# Altium project Zoom Camrea Controller V3.0.PrjPcb
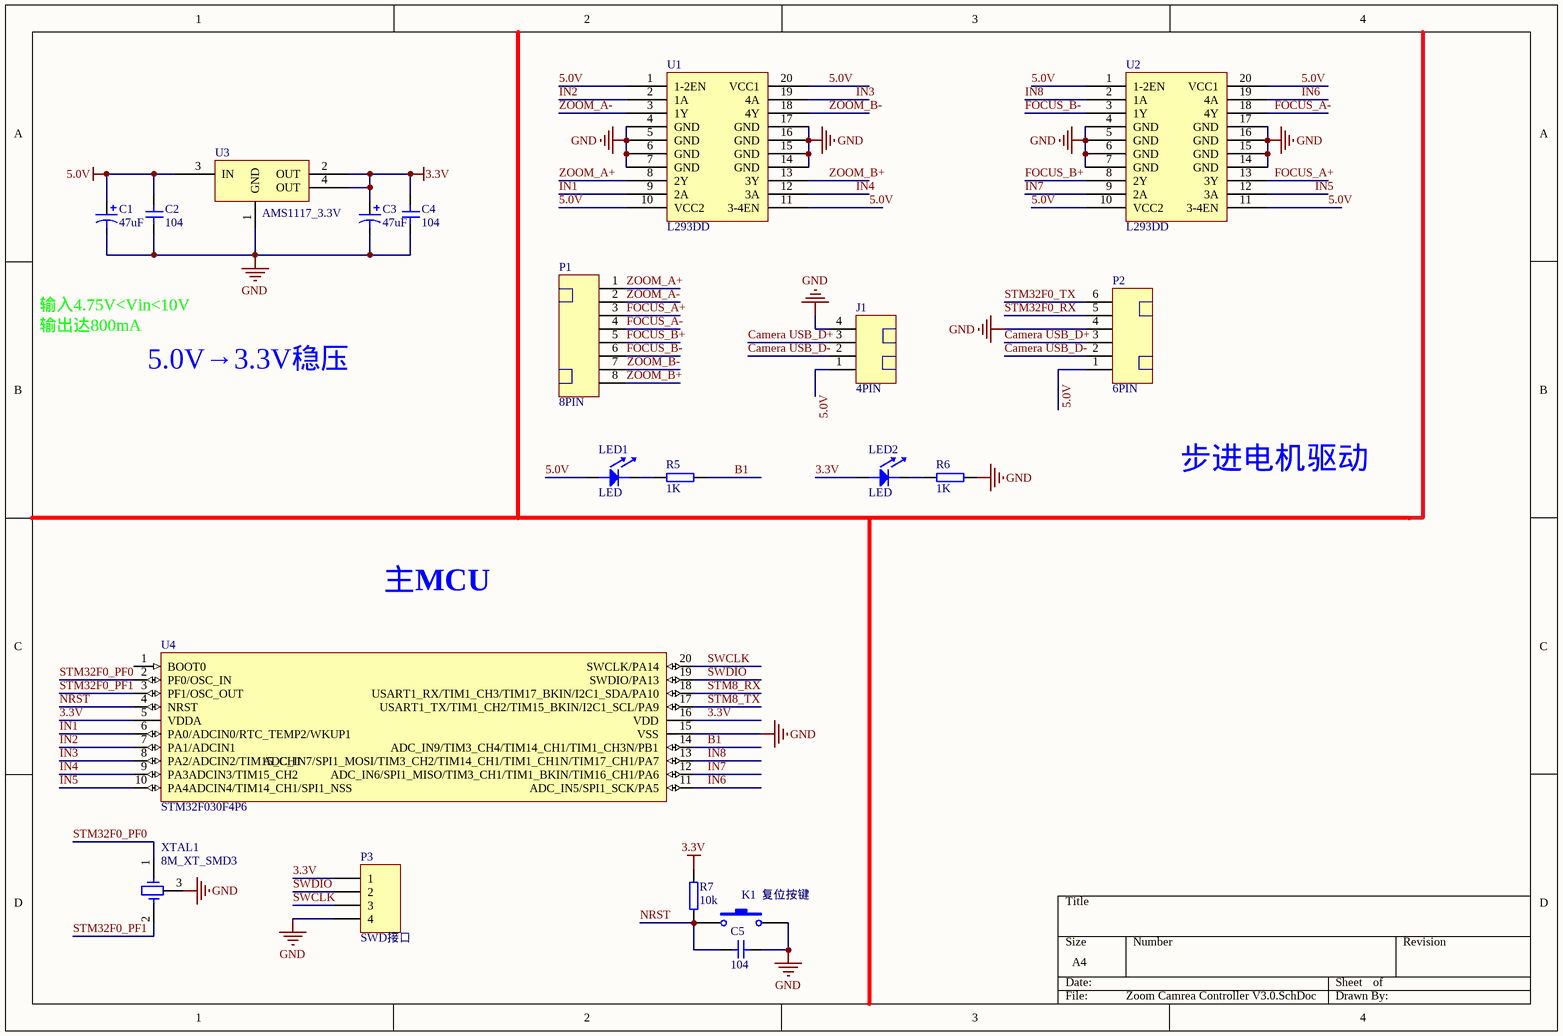
[diagram p0: Zoom Camrea Controller V3.0.SchDoc]
1 sheet, 20 parts. Net scope: global (net labels, ports and power ports of the same name join across sheets).
Board file: Zoom Camrea Controller V3.0.PcbDoc

## Sheet Zoom Camrea Controller V3.0.SchDoc
size A4

### Parts
C1  47uF  [TAJ-A]
C2  104  [0805C]
C3  47uF  [TAJ-A]
C4  104  [0805C]
C5  104  [0805C]
J1  4PIN  [MX1.25WS-4P]
K1  复位按键  [贴片按键]
LED1  LED  [0805LED(RED)]
LED2  LED  [0805LED(RED)]
P1  8PIN  [MX1.25WS-8P]
P2  6PIN  [MX1.25WS-6P]
P3  SWD接口  [Header 4]
R5  1K  [0805R]
R6  1K  [0805R]
R7  10k  [0805R]
U1  L293DD  [SOP-20]
U2  L293DD  [SOP-20]
U3  AMS1117_3.3V  [SOT-223]
U4  STM32F030F4P6  [STM32F030]
XTAL1  8M_XT_SMD3  [三脚贴片8M晶振]

### Nets
3.3V: C3.1 C4.2 LED2.1 P3.1 R7.2 U3.2(OUT) U3.4(OUT) U4.5(VDDA) U4.16(VDD)
5.0V: C1.1 C2.2 J1.1 LED1.1 P2.1 U1.1(1-2EN) U1.10(VCC2) U1.11(3-4EN) U1.20(VCC1) U2.1(1-2EN) U2.10(VCC2) U2.11(3-4EN) U2.20(VCC1) U3.3(IN)
GND: C1.2 C2.1 C3.2 C4.1 C5.1 J1.4 K1.2 P2.4 P3.4 R6.2 U1.4(GND) U1.5(GND) U1.6(GND) U1.7(GND) U1.14(GND) U1.15(GND) U1.16(GND) U1.17(GND) U2.4(GND) U2.5(GND) U2.6(GND) U2.7(GND) U2.14(GND) U2.15(GND) U2.16(GND) U2.17(GND) U3.1(GND) U4.15(VSS) XTAL1.3
B1: R5.2 U4.14(ADC_IN9/TIM3_CH4/TIM14_CH1/TIM1_CH3N/PB1)
Camera USB_D+: J1.3 P2.3
Camera USB_D-: J1.2 P2.2
FOCUS_A+: P1.3 U2.13(3Y)
FOCUS_A-: P1.4 U2.18(4Y)
FOCUS_B+: P1.5 U2.8(2Y)
FOCUS_B-: P1.6 U2.3(1Y)
IN1: U1.9(2A) U4.6(PA0/ADCIN0/RTC_TEMP2/WKUP1)
IN2: U1.2(1A) U4.7(PA1/ADCIN1)
IN3: U1.19(4A) U4.8(PA2/ADCIN2/TIM15_CH1)
IN4: U1.12(3A) U4.9(PA3ADCIN3/TIM15_CH2)
IN5: U2.12(3A) U4.10(PA4ADCIN4/TIM14_CH1/SPI1_NSS)
IN6: U2.19(4A) U4.11(ADC_IN5/SPI1_SCK/PA5)
IN7: U2.9(2A) U4.12(ADC_IN6/SPI1_MISO/TIM3_CH1/TIM1_BKIN/TIM16_CH1/PA6)
IN8: U2.2(1A) U4.13(ADC_IN7/SPI1_MOSI/TIM3_CH2/TIM14_CH1/TIM1_CH1N/TIM17_CH1/PA7)
NRST: C5.2 K1.1 R7.1 U4.4(NRST)
STM8_RX: U4.18(USART1_RX/TIM1_CH3/TIM17_BKIN/I2C1_SDA/PA10)
STM8_TX: U4.17(USART1_TX/TIM1_CH2/TIM15_BKIN/I2C1_SCL/PA9)
STM32F0_PF0: U4.2(PF0/OSC_IN) XTAL1.1
STM32F0_PF1: U4.3(PF1/OSC_OUT) XTAL1.2
STM32F0_RX: P2.5
STM32F0_TX: P2.6
SWCLK: P3.3 U4.20(SWCLK/PA14)
SWDIO: P3.2 U4.19(SWDIO/PA13)
ZOOM_A+: P1.1 U1.8(2Y)
ZOOM_A-: P1.2 U1.3(1Y)
ZOOM_B+: P1.8 U1.13(3Y)
ZOOM_B-: P1.7 U1.18(4Y)
NetLED1_2: LED1.2 R5.1
NetLED2_2: LED2.2 R6.1

Not connected (* = marked no-connect by the designer): U4 1(BOOT0)

### Notes on the sheet
- 输入4.75V<Vin<10V
- 输出达800mA
- 5.0V→3.3V稳压
- 步进电机驱动
- 主MCU

### Library data of the parts
C1 C3 = Pol Cap: 极性贴片电容
C2 C4 C5 = Cap1: 无极贴片电容
J1 = MX1.25-4P
K1 = 贴片按键: 轻触开关
LED1 LED2 = LED: 发光二极管
P1 = MX1.25-8P
P2 = MX1.25-6P
P3 = Header 4: Header, 4-Pin; LatestRevisionDate: 17-Jul-2002; LatestRevisionNote: Re-released for DXP Platform.; Publisher: Altium Limited
R5-R7 = Res: 电阻
U1 U2 = L293D
U3 = AMS1117-3.3V/5.0V: 电源芯片
U4 = STM32F030F4P6: ARM Cortex-M0 32-bit MCU, 16 KB Flash, 4 KB Internal RAM, 15 I/Os, 20-pin TSSOP, -40 to 85 degC, Tube; FLASH Size (Prog) (kB): 16; I/Os (High Current): 15; Internal RAM Size (kB): 4; Operating Frequency(F) (Processor speed) (MHz): 48; Supply Voltage(Vcc) min (V): 2.4; DatasheetVersion: Rev. 1; PackageVersion: Rev. 1, 11/2012; PackageReference: TSSOP20; PackageDescription: 20-Pin Thin Shrink Small Outline Package, 6.5 x 4.4 mm Body, 0.65 mm Pitch; Supplier 1: Digi-Key; Supplier Part Number 1: 497-14044-5-ND; Supplier 2: Newark; Supplier Part Number 2: 06X3648; Supplier 3: Mouser; Supplier Part Number 3: 511-STM32F030F4P6; Core: ARM Cortex-M0; Packing: Tube; Mounting Technology: Surface Mount; PartNumber: STM32F030F4P6; ComponentLink1Description: Manufacturer URL; ComponentLink1URL: http://www.st.com/web/en/home.html; ComponentLink2Description: Datasheet; ComponentLink2URL: http://www.st.com/st-web-ui/static/active/en/resource/technical/document/datasheet/DM00088500.pdf; ComponentLink3Description: Package Specification; ComponentLink3URL: http://www.st.com/st-web-ui/static/active/en/resource/technical/document/datasheet/DM00065136.pdf
XTAL1 = XTAL三脚贴片晶振